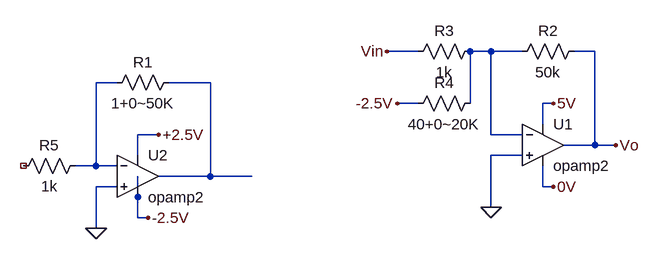
[diagram p0: schematic inv_amp_adder.asc]
inv_amp_adder.asc, the LTspice schematic file:
Version 4
SHEET 1 880 680
WIRE -48 0 -96 0
WIRE 64 0 32 0
WIRE 112 0 64 0
WIRE 224 0 192 0
WIRE -512 48 -544 48
WIRE -368 48 -432 48
WIRE -48 80 -80 80
WIRE 32 80 32 0
WIRE 160 80 144 80
WIRE 144 112 144 80
WIRE -448 128 -480 128
WIRE 64 128 64 0
WIRE 112 128 64 128
WIRE 224 144 224 0
WIRE 224 144 176 144
WIRE 256 144 224 144
WIRE -480 160 -480 128
WIRE 112 160 64 160
WIRE -544 176 -544 48
WIRE -544 176 -576 176
WIRE -512 176 -544 176
WIRE -368 192 -368 48
WIRE -368 192 -448 192
WIRE -304 192 -368 192
WIRE -512 208 -544 208
WIRE 144 208 144 176
WIRE 160 208 144 208
WIRE -480 224 -480 192
WIRE 64 240 64 160
WIRE -480 256 -480 224
WIRE -464 256 -480 256
WIRE -544 272 -544 208
FLAG 64 240 0
FLAG 160 80 5V
FLAG 160 208 0V
FLAG -96 0 Vin
FLAG -80 80 -2.5V
FLAG 256 144 Vo
FLAG -464 256 -2.5V
FLAG -448 128 +2.5V
FLAG -544 272 0
SYMBOL Opamps\\opamp2 144 80 R0
SYMATTR InstName U1
SYMBOL res 208 -16 R90
WINDOW 0 0 56 VBottom 2
WINDOW 3 32 56 VTop 2
SYMATTR InstName R2
SYMATTR Value 50k
SYMBOL res 48 -16 R90
WINDOW 0 0 56 VBottom 2
WINDOW 3 32 56 VTop 2
SYMATTR InstName R3
SYMATTR Value 1k
SYMBOL res 48 64 R90
WINDOW 0 0 56 VBottom 2
WINDOW 3 32 56 VTop 2
SYMATTR InstName R4
SYMATTR Value 40+0~20K
SYMBOL Opamps\\opamp2 -480 128 R0
SYMATTR InstName U2
SYMBOL res -416 32 R90
WINDOW 0 0 56 VBottom 2
WINDOW 3 32 56 VTop 2
SYMATTR InstName R1
SYMATTR Value 1+0~50K
SYMBOL res -560 160 R90
WINDOW 0 0 56 VBottom 2
WINDOW 3 32 56 VTop 2
SYMATTR InstName R5
SYMATTR Value 1k

The netlist it stands for:
* inv_amp_adder.asc
XU1 0 N001 5V 0V Vo opamp2  ; pins In+ In- V+ V- OUT
R2 Vo N001 50k
R3 N001 Vin 1k
R4 N001 -2.5V 40+0~20K
XU2 0 N002 +2.5V -2.5V N003 opamp2  ; pins In+ In- V+ V- OUT
R1 N003 N002 1+0~50K
R5 N002 NC_01 1k
.backanno
.end